# EAGLE schematic motherboard (EAGLE 9.4.2)
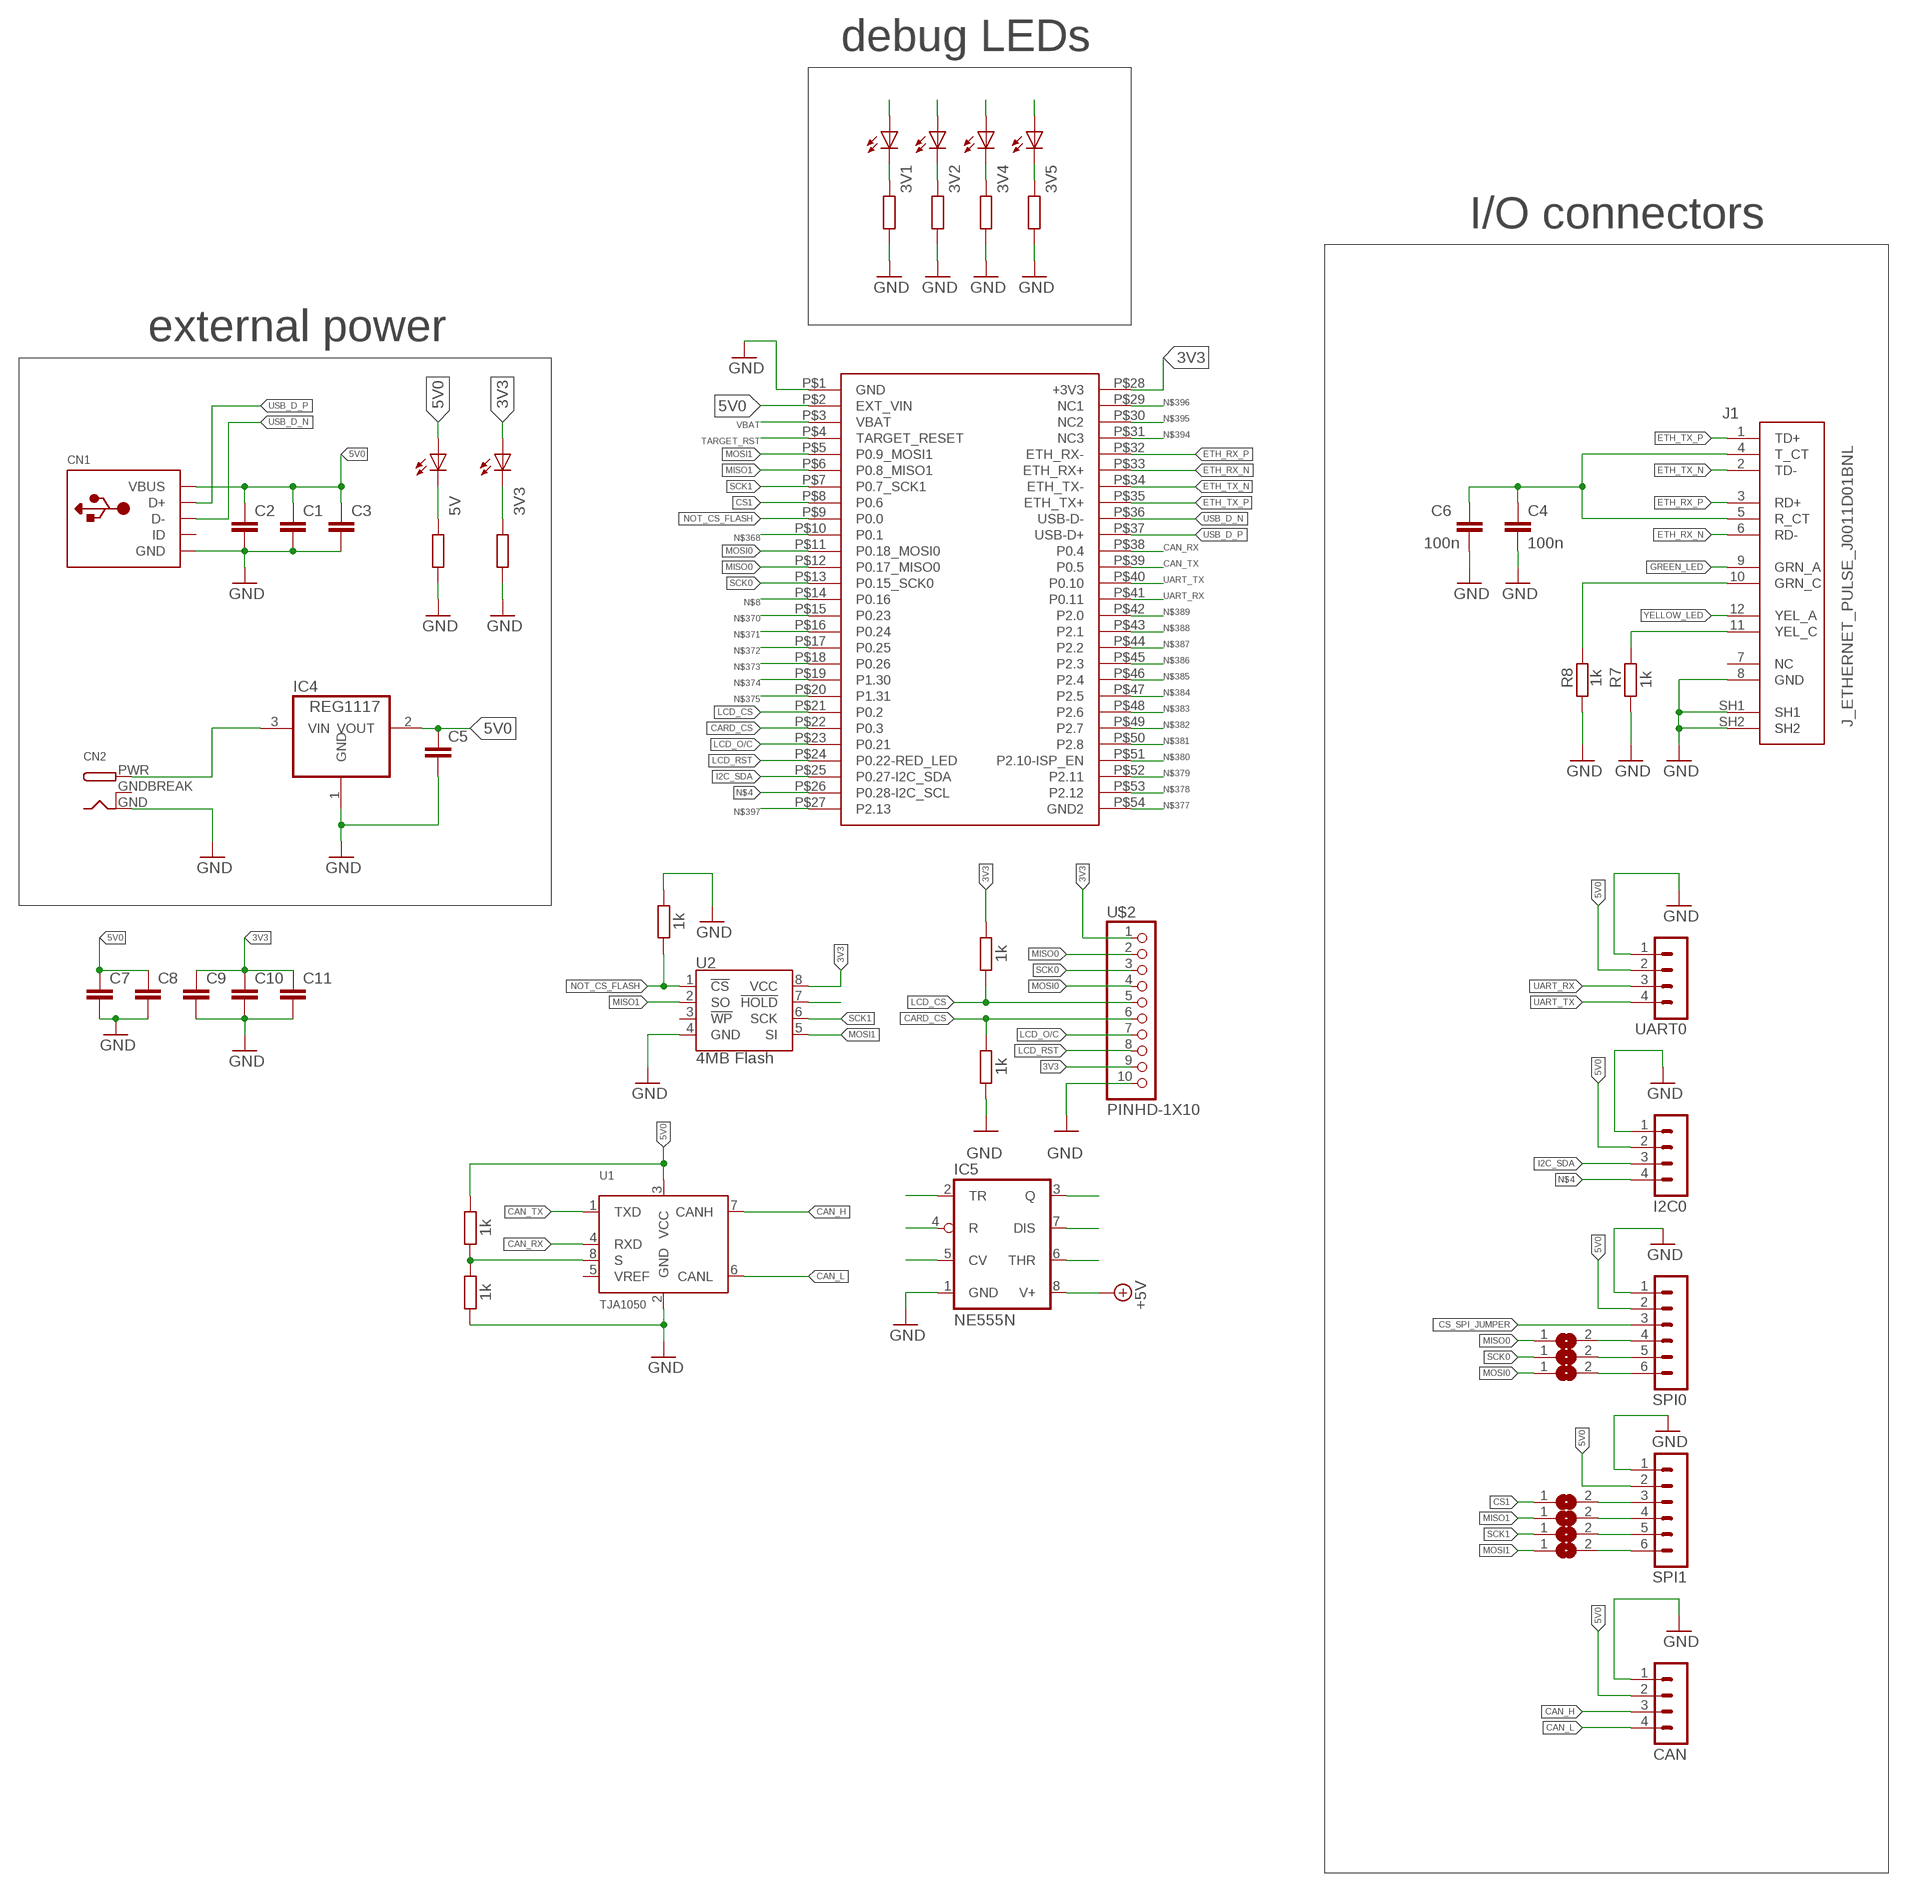
[diagram p0: schematic, sheet 1]

## Parts
3V1  LEDCHIPLED_0805  [CHIPLED_0805]
3V2  LEDCHIPLED_0805  [CHIPLED_0805]
3V3  LEDCHIPLED_0805  [CHIPLED_0805]
3V4  LEDCHIPLED_0805  [CHIPLED_0805]
3V5  LEDCHIPLED_0805  [CHIPLED_0805]
5V  LEDCHIPLED_0805  [CHIPLED_0805]
C1  C-EUC0805K  [C0805K]
C2  C-EUC0805K  [C0805K]
C3  C-EUC0805K  [C0805K]
C4  100n  C-EUC0805K  [C0805K]
C5  C-EUC0805K  [C0805K]
C6  100n  C-EUC0805K  [C0805K]
C7  C-EUC0805K  [C0805K]
C8  C-EUC0805K  [C0805K]
C9  C-EUC0805K  [C0805K]
C10  C-EUC0805K  [C0805K]
C11  C-EUC0805K  [C0805K]
CAN  MA04-1  [MA04-1]
CN1  USBMINIB  [USB-MINIB]
CN2  DCBARRELPTH  [DCJACK_2MM_PTH]
I2C0  MA04-1  [MA04-1]
IC4  REG1117  [SOT223]
IC5  NE555N  [DIL08]
J1  J_ETHERNET_PULSE_J0011D01BNL  [J_ETHERNET_PULSE_J0011D01BNL]
R1  1k  R-EU_R0805  [R0805]
R2  1k  R-EU_R0805  [R0805]
R3  R-EU_R0805  [R0805]
R4  R-EU_R0805  [R0805]
R5  1k  R-EU_R0805  [R0805]
R6  1k  R-EU_R0805  [R0805]
R7  1k  R-EU_R0805  [R0805]
R8  1k  R-EU_R0805  [R0805]
R9  R-EU_R0805  [R0805]
R10  R-EU_R0805  [R0805]
R11  R-EU_R0805  [R0805]
R12  R-EU_R0805  [R0805]
R13  1k  R-EU_R0805  [R0805]
SJ1  SJ  [SJ]
SJ2  SJ  [SJ]
SJ3  SJ  [SJ]
SJ5  SJ  [SJ]
SJ6  SJ  [SJ]
SJ7  SJ  [SJ]
SJ8  SJ  [SJ]
SPI0  MA06-1  [MA06-1]
SPI1  MA06-1  [MA06-1]
U1  TJA1050  [SOT96-1]
U2  4MB Flash  AT25SF041  [SO08]
U$1  LPC1769XPRESSO  [LPC1769XPRESSO]
U$2  PINHD-1X10  [1X10-BIG]
UART0  MA04-1  [MA04-1]

## Nets
3V1: 3V1.A
3V2: 3V2.A
3V3: 3V3.A C4.1 C6.1 C9.1 C10.1 C11.1 J1.4(T_CT) J1.5(R_CT) R1.2 U2.8(VCC) U$1.P$28(+3V3) U$2.1 U$2.9
3V4: 3V4.A
3V5: 3V5.A
5V0: 5V.A C1.1 C2.1 C3.1 C5.1 C7.1 C8.1 CAN.2 CN1.VBUS I2C0.2 IC4.2(VOUT) R6.2 SPI0.2 SPI1.2 U1.3(VCC) U$1.P$2(EXT_VIN) UART0.2
12V0: CN2.PWR IC4.3(VIN)
+5V: IC5.8(V+)
CAN_H: CAN.3 U1.7(CANH)
CAN_L: CAN.4 U1.6(CANL)
CAN_RX: U1.4(RXD) U$1.P$38(P0.4)
CAN_TX: U1.1(TXD) U$1.P$39(P0.5)
CARD_CS: R2.2 U$1.P$22(P0.3) U$2.6
CS1: SJ8.1 U$1.P$8(P0.6)
CS_SPI_JUMPER: SPI0.3
ETH_RX_N: J1.6(RD-) U$1.P$33(ETH_RX+)
ETH_RX_P: J1.3(RD+) U$1.P$32(ETH_RX-)
ETH_TX_N: J1.2(TD-) U$1.P$34(ETH_TX-)
ETH_TX_P: J1.1(TD+) U$1.P$35(ETH_TX+)
GND: C1.2 C2.2 C3.2 C4.2 C5.2 C6.2 C7.2 C8.2 C9.2 C10.2 C11.2 CAN.1 CN1.GND CN2.GND I2C0.1 IC4.1(GND) IC5.1(GND) J1.8(GND) J1.SH1 J1.SH2 R2.1 R3.1 R4.1 R5.2 R7.1 R8.1 R9.1 R10.1 R11.1 R12.1 R13.1 SPI0.1 SPI1.1 U1.2(GND) U2.4(GND) U$1.P$1(GND) U$2.10 UART0.1
GREEN_LED: J1.9(GRN_A)
I2C_SDA: I2C0.3 U$1.P$25(P0.27-I2C_SDA)
LCD_CS: R1.1 U$1.P$21(P0.2) U$2.5
LCD_O/C: U$1.P$23(P0.21) U$2.7
LCD_RST: U$1.P$24(P0.22-RED_LED) U$2.8
MISO0: SJ3.1 U$1.P$12(P0.17_MISO0) U$2.2
MISO1: SJ7.1 U2.2(SO) U$1.P$6(P0.8_MISO1)
MOSI0: SJ1.1 U$1.P$11(P0.18_MOSI0) U$2.4
MOSI1: SJ5.1 U2.5(SI) U$1.P$5(P0.9_MOSI1)
N$1: 5V.C R3.2
N$3: 3V3.C R4.2
N$4: I2C0.4 U$1.P$26(P0.28-I2C_SCL)
N$8: U$1.P$14(P0.16)
N$9: SJ1.2 SPI0.6
N$10: SJ2.2 SPI0.5
N$11: SJ3.2 SPI0.4
N$30: R6.1 R13.2 U1.8(S)
N$57: IC5.2(TR)
N$58: IC5.4(R)
N$59: IC5.5(CV)
N$60: J1.11(YEL_C) R7.2
N$61: J1.10(GRN_C) R8.2
N$62: U2.7(!HOLD)
N$64: IC5.6(THR)
N$65: IC5.7(DIS)
N$66: IC5.3(Q)
N$67: 3V1.C R9.2
N$68: 3V2.C R10.2
N$69: 3V4.C R11.2
N$70: 3V5.C R12.2
N$368: U$1.P$10(P0.1)
N$370: U$1.P$15(P0.23)
N$371: U$1.P$16(P0.24)
N$372: U$1.P$17(P0.25)
N$373: U$1.P$18(P0.26)
N$374: U$1.P$19(P1.30)
N$375: U$1.P$20(P1.31)
N$376: SJ5.2 SPI1.6
N$377: U$1.P$54(GND2)
N$378: U$1.P$53(P2.12)
N$379: U$1.P$52(P2.11)
N$380: U$1.P$51(P2.10-ISP_EN)
N$381: U$1.P$50(P2.8)
N$382: U$1.P$49(P2.7)
N$383: U$1.P$48(P2.6)
N$384: U$1.P$47(P2.5)
N$385: U$1.P$46(P2.4)
N$386: U$1.P$45(P2.3)
N$387: U$1.P$44(P2.2)
N$388: U$1.P$43(P2.1)
N$389: U$1.P$42(P2.0)
N$394: U$1.P$31(NC3)
N$395: U$1.P$30(NC2)
N$396: U$1.P$29(NC1)
N$397: U$1.P$27(P2.13)
N$398: SJ6.2 SPI1.5
N$399: SJ7.2 SPI1.4
N$400: SJ8.2 SPI1.3
NOT_CS_FLASH: R5.1 U2.1(!CS) U$1.P$9(P0.0)
SCK0: SJ2.1 U$1.P$13(P0.15_SCK0) U$2.3
SCK1: SJ6.1 U2.6(SCK) U$1.P$7(P0.7_SCK1)
TARGET_RST: U$1.P$4(TARGET_RESET)
UART_RX: U$1.P$41(P0.11) UART0.3
UART_TX: U$1.P$40(P0.10) UART0.4
USB_D_N: CN1.D- U$1.P$36(USB-D-)
USB_D_P: CN1.D+ U$1.P$37(USB-D+)
VBAT: U$1.P$3(VBAT)
YELLOW_LED: J1.12(YEL_A)
Unconnected: CN1.ID J1.7(NC) U1.5(VREF) U2.3(!WP)

## Notes on the sheet
- debug LEDs
- I/O connectors
- external power

## Power pins joined to a net without a drawn wire
GNDBREAK: CN2.GNDBREAK

## Library data of the parts
3V1-3V5 5V = adafruit:LED: LED OSRAM: - CHIPLED LG R971, LG N971, LY N971, LG Q971, LY Q971, LO R971, LY R971 LH N974, LH R974 LS Q976, LO Q976, LY Q976 LO Q996 - Hyper CHIPLED LW Q18S LB Q993, LB Q99A, LB R99A - SideLED LS A670, LO A670, LY A670, LG A670, LP A670 LB A673, LV A673, LT A673, LW A673 LH A674 LY A675 LS A676, LA A676, LO A676, LY A676, LW A676 LS A679, LY A679, LG A679 - Hyper Micro SIDELED® LS Y876, LA Y876, LO Y876, LY Y876 LT Y87S - SmartLED LW L88C, LW L88S LB L89C, LB L89S, LG L890 LS L89K, LO L89K, LY L89K LS L896, LA L896, LO L896, LY L896 - TOPLED LS T670, LO T670, LY T670, LG T670, LP T670 LSG T670, LSP T670, LSY T670, LOP T670, LYG T670 LG T671, LOG T671, LSG T671 LB T673, LV T673, LT T673, LW T673 LH T674 LS T676, LA T676, LO T676, LY T676, LB T676, LH T676, LSB T676, LW T676 LB T67C, LV T67C, LT T67C, LS T67K, LO T67K, LY T67K, LW E67C LS E67B, LA E67B, LO E67B, LY E67B, LB E67C, LV E67C, LT E67C LW T67C LS T679, LY T679, LG T679 LS T770, LO T770, LY T770, LG T770, LP T770 LB T773, LV T773, LT T773, LW T773 LH T774 LS E675, LA E675, LY E675, LS T675 LS T776, LA T776, LO T776, LY T776, LB T776 LHGB T686 LT T68C, LB T68C - Hyper Mini TOPLED® LB M676 - Mini TOPLED Santana® LG M470 LS M47K, LO M47K, LY M47K Source: http://www.osram.convergy.de/
C1-C11 = rcl:C-EU: CAPACITOR, European symbol; SPICEPREFIX: C
CAN I2C0 UART0 = con-lstb:MA04-1: PIN HEADER; OC_FARNELL: unknown; OC_NEWARK: unknown
CN1 = adafruit:USB: USB Connectors USBMINIB - Surface Mount Female Mini-B USB Connector 4UConnector: 06564 By microbuilder.eu Thru-hole RA Female Mini-B USB Connector 4UConnector: 18732 By ladyada.net
CN2 = adafruit:DCBARREL: 2.0mm DC Barrel Jack DCJACK_2MM_PTH - Through Hole Jack (4UConnector: 05537)
IC4 = burr-brown:REG1117: 800mA and 1A Low Dropout (LDO) Positive Regulator 1.8V, 2.5V, 2.85V, 3.3V, 5V, and Adj; MPN: REG1117; OC_FARNELL: 1097566; OC_NEWARK: 14P6981
IC5 = linear:*555: TIMER
J1 = j_ethernet_pulse_j0011d01bnl:J_ETHERNET_PULSE_J0011D01BNL: Pulse J0011D01BLS 10/100 ethernet jack with green and yellow LEDs, and built-in magnetics. No EMI spring fingers.
R1-R13 = rcl:R-EU_: RESISTOR, European symbol; SPICEPREFIX: R
SJ1-SJ3 SJ5-SJ8 = jumper:SJ: SMD solder JUMPER
SPI0 SPI1 = con-lstb:MA06-1: PIN HEADER; OC_FARNELL: unknown; OC_NEWARK: unknown
U1 = NXP_60_26022015:TJA1050: High speed CAN transceiver The TJA1050 is the interface between the Controller Area Network (CAN) protocol controller and the physical bus. The device provides differential transmit capability to the bus and differential receive capability to the CAN controller. The TJA1050 is the third Philips high-speed CAN transceiver after the PCA82C250 and the PCA82C251. The most important differences are: Much lower electromagnetic emission due to optimal matching of the output signals CANH and CANL Improved behaviour in case of an unpowered node No standby mode. This makes the TJA1050 eminently suitable for use in nodes that are in a power-down situation in partially powered networks. AAL Eindhoven MK
U2 = SparkFun-IC-Memory:AT25SF041: AT25SF041 4Mb Serial Flash Memory 104MHz, SPI, 8-SOIC Datasheet <http://www.adestotech.com/wp-content/uploads/DS-AT25SF041_044.pdf> SparkFun Products: SparkFun ESP8266 Thing <https://www.sparkfun.com/products/13231> SparkFun ESP8266 Thing - Dev Board <https://www.sparkfun.com/products/13711>; PROD_ID: IC-12455
U$1 = xpressoLPC1769:LPC1769XPRESSO
U$2 = adafruit:PINHD-1X10: Pin header 1x10 0.1" spacing With round pins

## Net classes
1 power: width 0.406 mm